# Altium project DiffTorch-PowerStage.PrjPcb
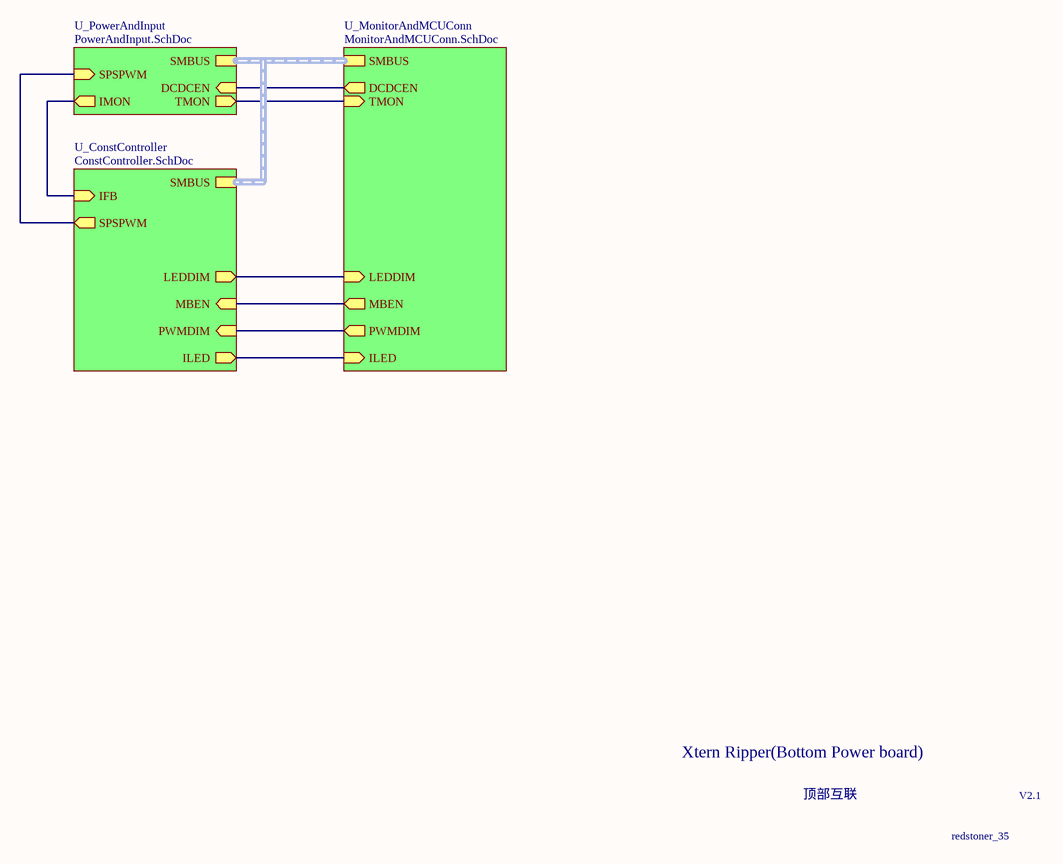
[diagram p0: main.SchDoc]
4 sheets, 73 parts. Net scope: hierarchical (ports join the sheet entries above them; power ports are global).
Board file: PCB1.PcbDoc
Sheets:
  main.SchDoc
    U_ConstController = ConstController.SchDoc
    U_MonitorAndMCUConn = MonitorAndMCUConn.SchDoc
    U_PowerAndInput = PowerAndInput.SchDoc

## Sheet main.SchDoc
size A4

### Sub-sheets
U_ConstController = ConstController.SchDoc: IFB (in), SPSPWM (out), SMBUS (harness SMBUS), PWMDIM (in), MBEN (in), ILED (out), LEDDIM (out)
U_MonitorAndMCUConn = MonitorAndMCUConn.SchDoc: SMBUS (harness SMBUS), PWMDIM (out), DCDCEN (out), MBEN (out), ILED (in), LEDDIM (in), TMON (in)
U_PowerAndInput = PowerAndInput.SchDoc: SMBUS (harness SMBUS), DCDCEN (in), TMON (out), IMON (out), SPSPWM (in)

### Nets
DCDCEN: sheet U_MonitorAndMCUConn/DCDCEN, sheet U_PowerAndInput/DCDCEN
IFB+: sheet U_ConstController/IFB, sheet U_PowerAndInput/IMON
ILEDO: sheet U_ConstController/ILED, sheet U_MonitorAndMCUConn/ILED
LEDDIM: sheet U_ConstController/LEDDIM, sheet U_MonitorAndMCUConn/LEDDIM
MBUCKEN: sheet U_ConstController/MBEN, sheet U_MonitorAndMCUConn/MBEN
PWM: sheet U_ConstController/SPSPWM, sheet U_PowerAndInput/SPSPWM
PWMDIM: sheet U_ConstController/PWMDIM, sheet U_MonitorAndMCUConn/PWMDIM
SPSTEMP: sheet U_MonitorAndMCUConn/TMON, sheet U_PowerAndInput/TMON

### Buses and harness runs
harness sheet U_ConstController/SMBUS = sheet U_MonitorAndMCUConn/SMBUS = sheet U_PowerAndInput/SMBUS

### Notes on the sheet
- Xtern Ripper(Bottom Power board)
- 顶部互联
- V2.1
- redstoner_35

## Sheet ConstController.SchDoc
size A4
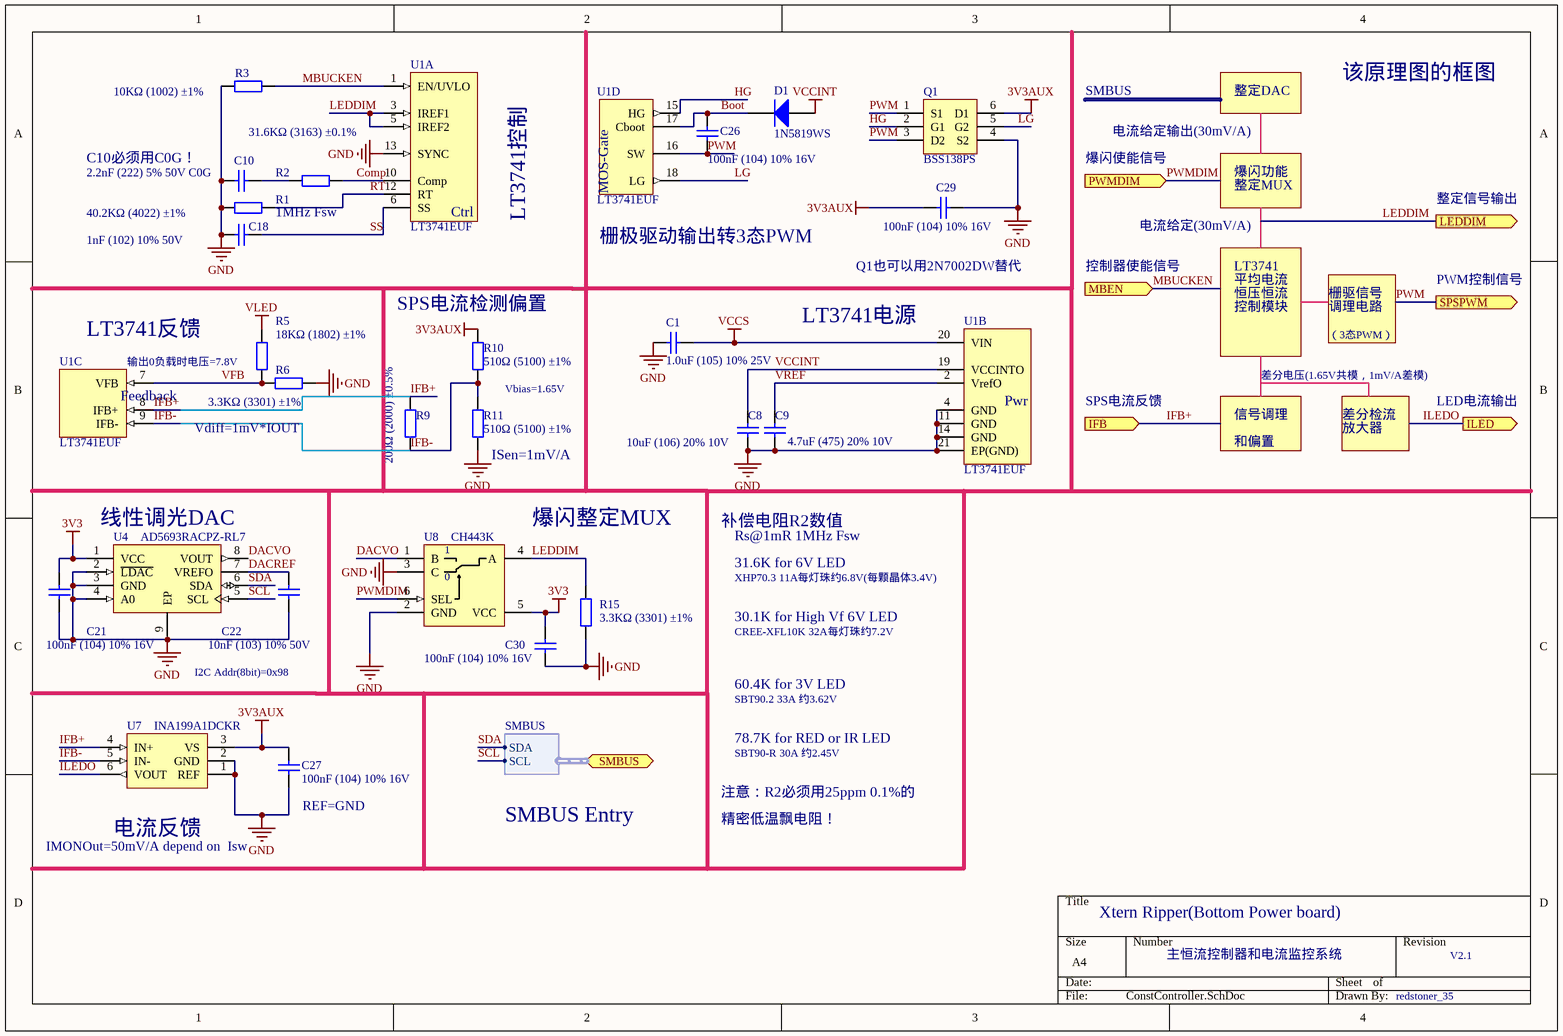
[diagram p1: ConstController.SchDoc]

### Parts
C1  1.0uF (105) 10% 25V  [0402_C]
C8  10uF (106) 20% 10V  [0402_C]
C9  4.7uF (475) 20% 10V  [0402_C]
C10  2.2nF (222) 5% 50V C0G  [0402_C]
C18  1nF (102) 10% 50V  [0402_C]
C21  100nF (104) 10% 16V  [0402_C]
C22  10nF (103) 10% 50V  [0402_C]
C26  100nF (104) 10% 16V  [0402_C]
C27  100nF (104) 10% 16V  [0402_C]
C29  100nF (104) 10% 16V  [0402_C]
C30  100nF (104) 10% 16V  [0402_C]
D1  1N5819WS  [SOD-323]
Q1  BSS138PS  [SC70-6]
R1  40.2KΩ (4022) ±1%  [0402_R]
R2  31.6KΩ (3163) ±0.1%  [0402_R]
R3  10KΩ (1002) ±1%  [0402_R]
R5  18KΩ (1802) ±1%  [0402_R]
R6  3.3KΩ (3301) ±1%  [0402_R]
R9  200Ω (2000) ±0.5%  [0402_R]
R10  510Ω (5100) ±1%  [0402_R]
R11  510Ω (5100) ±1%  [0402_R]
R15  3.3KΩ (3301) ±1%  [0402_R]
U1  LT3741EUF  [UF-05-08-1710A]  (parts A,B,C,D of 4)
U4  AD5693RACPZ-RL7  [LFCSP-8-10]
U7  INA199A1DCKR  [SC70-6]
U8  CH443K  [SC70-6]

### Ports
IFB (in), ILED (out), LEDDIM (out), MBEN (in), PWMDIM (in), SMBUS (harness SMBUS), SPSPWM (out)

### Harnesses
SMBUS: SDA, SCL

### Nets
3V3: C21.2 C30.2 U4.1(VCC) U8.5(VCC)
3V3AUX: C27.1 C29.1 Q1.6(D1) R10.1 U7.3(VS)
GND: C1.1 C8.1 C9.1 C10.2 C18.1 C21.1 C22.1 C27.2 C29.2 C30.1 Q1.4(S2) R1.1 R3.1 R6.2 R11.2 R15.1 U1.4(GND) U1.11(GND) U1.13(SYNC) U1.14(GND) U1.21(EP(GND)) U4.2(~{LDAC}) U4.3(GND) U4.4(A0) U4.9(EP) U7.1(REF) U7.2(GND) U8.2(GND) U8.3(C)
VCCINT: C8.2 D1.1(A) U1.19(VCCINTO)
VCCS: C1.2 U1.20(VIN)
VLED: R5.2
Boot: C26.2 D1.2(K) U1.17(Cboot)
Comp: R2.1 U1.10(Comp)
DACREF: C22.2 U4.7(VREFO)
DACVO: U4.8(VOUT) U8.1(B)
HG: Q1.2(G1) U1.15(HG)
IFB+: R9.2 U1.8(IFB+) U7.4(IN+) ; port IFB
IFB-: R9.1 R10.2 R11.1 U1.9(IFB-) U7.5(IN-)
ILEDO: U7.6(VOUT) ; port ILED
LEDDIM: R15.2 U1.3(IREF1) U1.5(IREF2) U8.4(A) ; port LEDDIM
LG: Q1.5(G2) U1.18(LG)
MBUCKEN: R3.2 U1.1(EN/UVLO) ; port MBEN
PWM: C26.1 Q1.1(S1) Q1.3(D2) U1.16(SW) ; port SPSPWM
PWMDIM: U8.6(SEL) ; port PWMDIM
RT: R1.2 U1.12(RT)
SCL: U4.5(SCL) ; port SMBUS.SCL
SDA: U4.6(SDA) ; port SMBUS.SDA
SS: C18.2 U1.6(SS)
VFB: R5.1 R6.1 U1.7(VFB)
VREF: C9.2 U1.2(VrefO)
NetC10_1: C10.1 R2.2

### Notes on the sheet
- SMBUS
- 整定DAC
- 该原理图的框图
- C10必须用C0G！
- 爆闪使能信号
- 电流给定输出(30mV/A)
- 爆闪功能
- (near R1) 1MHz Fsw
- LT3741控制
- (near U1) 栅极驱动输出转3态PWM
- 电流给定(30mV/A)
- 整定MUX
- 整定信号输出
- (near R10) SPS电流检测偏置
- Q1也可以用2N7002DW替代
- 控制器使能信号
- LT3741
- 平均电流
- 恒压恒流
- 控制模块
- 栅驱信号
- 调理电路
- PWM控制信号
- (near U1) LT3741反馈
- (near U1) 输出0负载时电压=7.8V
- LT3741电源
- 差分电压(1.65V共模，1mV/A差模)
- （3态PWM）
- Vdiff=1mV*IOUT
- Vbias=1.65V
- SPS电流反馈
- 信号调理
- 和偏置
- 差分检流
- 放大器
- LED电流输出
- (near R11) ISen=1mV/A
- (near U4) 线性调光DAC
- (near U8) 爆闪整定MUX
- 补偿电阻R2数值
- 31.6K for 6V LED
- Rs@1mR 1MHz Fsw
- XHP70.3 11A每灯珠约6.8V(每颗晶体3.4V)
- 30.1K for High Vf 6V LED
- CREE-XFL10K 32A每灯珠约7.2V
- I2C Addr(8bit)=0x98
- SBT90.2 33A 约3.62V
- 60.4K for 3V LED
- 78.7K for RED or IR LED
- SBT90-R 30A 约2.45V
- IMONOut=50mV/A depend on  Isw
- (near U7) 电流反馈
- (near C27) REF=GND
- SMBUS Entry
- 注意：R2必须用25ppm 0.1%的
- 精密低温飘电阻！
- Xtern Ripper(Bottom Power board)
- 主恒流控制器和电流监控系统
- V2.1
- redstoner_35
- (in symbol LT3741EUF, part A) Ctrl
- (in symbol LT3741EUF, part B) Pwr
- (in symbol LT3741EUF, part C) Feedback
- (in symbol LT3741EUF, part D) MOS-Gate
- (in symbol NC7SB3157P6X) 0

### Library data of the parts
C1 = 0402 1.0uF (105) 10% 25V: 贴片电容; ComponentLink1Description: 供应商链接; ComponentLink1URL: http://www.szlcsc.com/product/details_53938.html; Package: 0402; Supplier: LC; SuppliersPartNumber: C52923
C8 C9 = 0402 4.7uF (475) 20% 10V: 贴片电容; ComponentLink1Description: 供应商链接; ComponentLink1URL: http://www.szlcsc.com/product/details_24469.html; Package: 0402; Supplier: LC
  C8: SuppliersPartNumber: C??????
  C9: SuppliersPartNumber: C23733
C10 = 0402 2.2nF (222) 10% 50V: 贴片电容; Material: C0G/NP0; ComponentLink1Description: 供应商链接; ComponentLink1URL: http://www.szlcsc.com/product/details_1883.html; Package: 0402; Supplier: LC; SuppliersPartNumber: C?????????
C18 = 0402 1nF (102) 10% 50V: 贴片电容; ComponentLink1Description: 供应商链接; ComponentLink1URL: http://www.szlcsc.com/product/details_1875.html; Package: 0402; Supplier: LC; SuppliersPartNumber: C1523
C21 C26 C27 C29 C30 = 0402 100nF (104) 10% 16V: 贴片电容; ComponentLink1Description: 供应商链接; ComponentLink1URL: http://www.szlcsc.com/product/details_1877.html; Package: 0402; Supplier: LC; SuppliersPartNumber: C1525
C22 = 0402 10nF (103) 10% 50V: 贴片电容; ComponentLink1Description: 供应商链接; ComponentLink1URL: http://www.szlcsc.com/product/details_15869.html; Package: 0402; Supplier: LC; SuppliersPartNumber: C15195
D1 = SOD-323 1N4148WS T4: 二极管; ComponentLink1Description: 供应商链接; ComponentLink1URL: http://www.szlcsc.com/product/details_2485.html; Package: SOD-323; Supplier: LC; SuppliersPartNumber: C?????
Q1 = 2N7002DW: Dual N-Channel MOSFET 60V320mA SOT-363
R1 R2 = 0402 49.9KΩ (4992) 1%: 贴片电阻; ComponentLink1Description: 供应商链接; ComponentLink1URL: http://www.szlcsc.com/product/details_26640.html; Package: 0402; Supplier: LC; SuppliersPartNumber: C??????
R3 = 0402 10KΩ (1002) 1%: 贴片电阻; ComponentLink1Description: 供应商链接; ComponentLink1URL: http://www.szlcsc.com/product/details_26487.html; Package: 0402; Supplier: LC; SuppliersPartNumber: C25744
R5 = 0402 18KΩ (1802) 1%: 贴片电阻; ComponentLink1Description: 供应商链接; ComponentLink1URL: http://www.szlcsc.com/product/details_26505.html; Package: 0402; Supplier: LC; SuppliersPartNumber: C25762
R6 R15 = 0402 3.3KΩ (3301) 1%: 贴片电阻; ComponentLink1Description: 供应商链接; ComponentLink1URL: http://www.szlcsc.com/product/details_26633.html; Package: 0402; Supplier: LC; SuppliersPartNumber: C25890
R9 = 0402 200Ω (2000) 1%: 贴片电阻; ComponentLink1Description: 供应商链接; ComponentLink1URL: http://www.szlcsc.com/product/details_25830.html; Package: 0402; Supplier: LC; SuppliersPartNumber: C????
R10 R11 = 0402 510Ω (5100) 1%: 贴片电阻; ComponentLink1Description: 供应商链接; ComponentLink1URL: http://www.szlcsc.com/product/details_25866.html; Package: 0402; Supplier: LC; SuppliersPartNumber: C25123
U1 = LT3741EUF: Constant Voltage/Current Sync Buck controller(external switch)
U4 = AD5693RACPZ-RL7: 16bit I2C Nano DAC with 2.5V internal Ref in 2x2mm SON
U7 = INA199A2DCKR: 50Khz 50V/V 26V Max High Side Current Op Amp.
U8 = NC7SB3157P6X: Low-Voltage Analog Switch SPDT,1.8-5V Power

## Sheet MonitorAndMCUConn.SchDoc
size A4
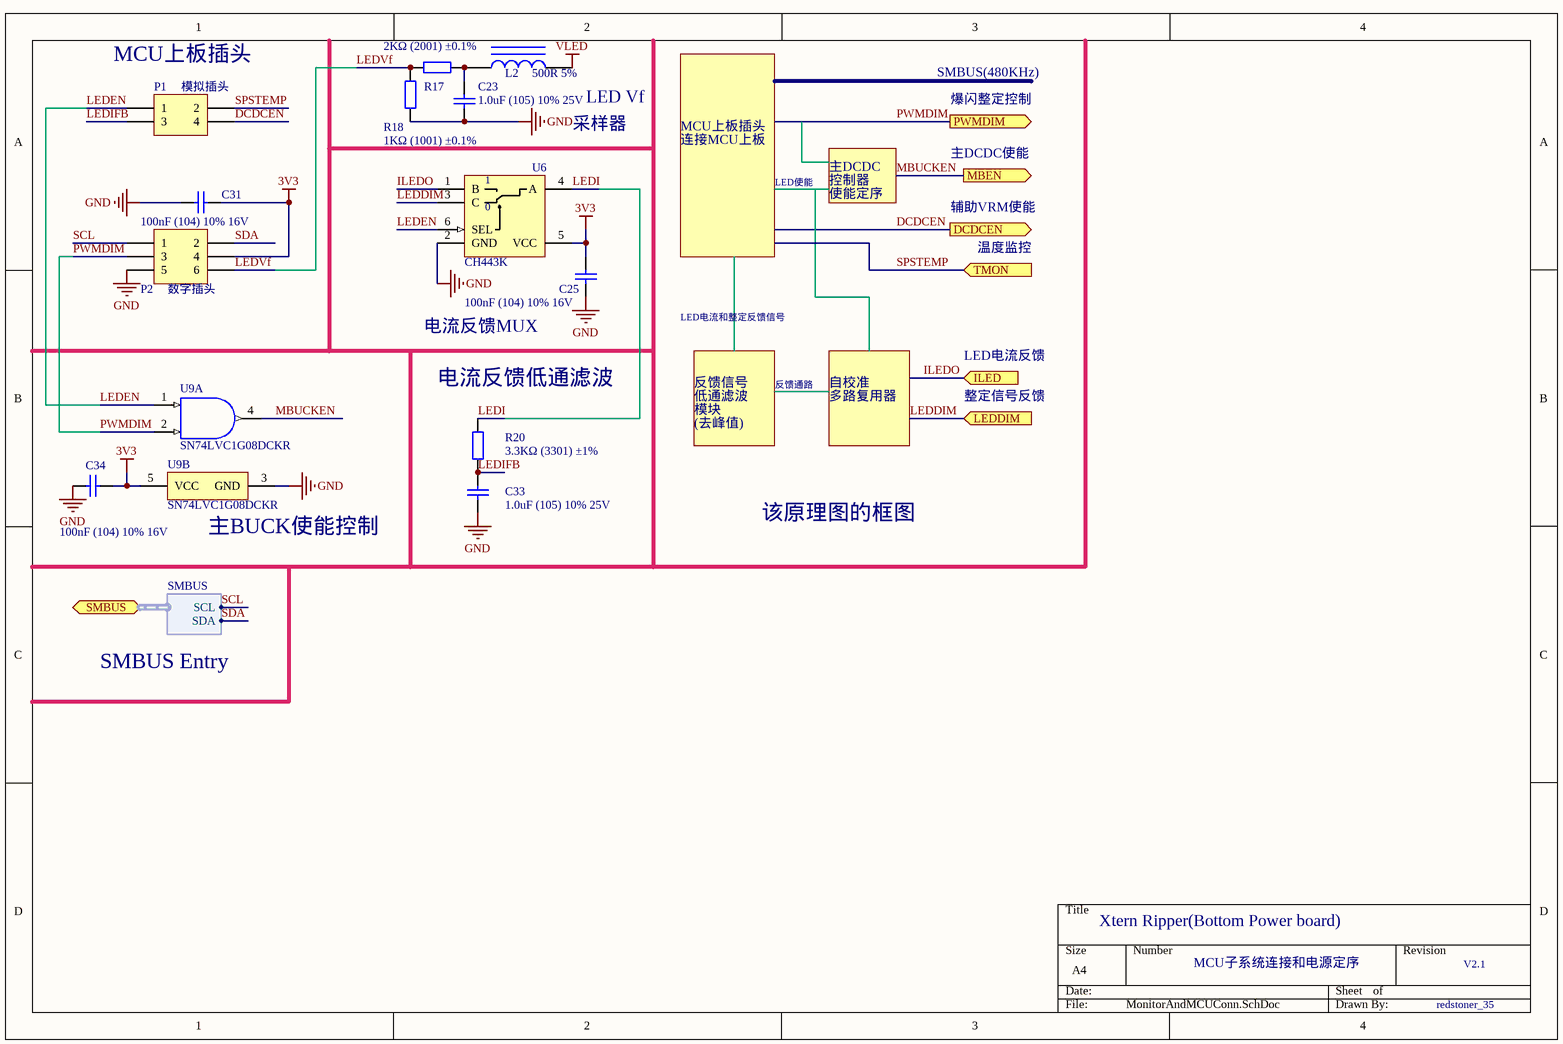
[diagram p2: MonitorAndMCUConn.SchDoc]

### Parts
C23  1.0uF (105) 10% 25V  [0402_C]
C25  100nF (104) 10% 16V  [0402_C]
C31  100nF (104) 10% 16V  [0402_C]
C33  1.0uF (105) 10% 25V  [0402_C]
C34  100nF (104) 10% 16V  [0402_C]
L2  500R 5%  [0402_L]
P1  模拟插头  [MHDR2X2]
P2  数字插头  [MHDR2X3]
R17  2KΩ (2001) ±0.1%  [0402_R]
R18  1KΩ (1001) ±0.1%  [0402_R]
R20  3.3KΩ (3301) ±1%  [0402_R]
U6  CH443K  [SC70-6]
U9  SN74LVC1G08DCKR  [DCK0005A_N]  (parts A,B of 2)

### Ports
DCDCEN (out), ILED (in), LEDDIM (in), MBEN (out), PWMDIM (out), SMBUS (harness SMBUS), TMON (in)

### Harnesses
SMBUS: SDA, SCL

### Nets
3V3: C25.2 C31.2 C34.2 P2.4 U6.5(VCC) U9.5(VCC)
GND: C23.1 C25.1 C31.1 C33.1 C34.1 P2.5 R18.1 U6.2(GND) U9.3(GND)
VLED: L2.1
DCDCEN: P1.4 ; port DCDCEN
ILEDO: U6.1(B) ; port ILED
LEDDIM: U6.3(C) ; port LEDDIM
LEDEN: P1.1 U6.6(SEL) U9.1(A)
LEDI: R20.2 U6.4(A)
LEDIFB: C33.2 P1.3 R20.1
LEDVf: P2.6 R17.2 R18.2
MBUCKEN: U9.4(Y) ; port MBEN
PWMDIM: P2.3 U9.2(B) ; port PWMDIM
SCL: P2.1 ; port SMBUS.SCL
SDA: P2.2 ; port SMBUS.SDA
SPSTEMP: P1.2 ; port TMON
NetC23_2: C23.2 L2.2 R17.1

### Notes on the sheet
- (near P1) MCU上板插头
- (near L2) LED Vf
- SMBUS(480KHz)
- 爆闪整定控制
- 采样器
- MCU上板插头
- 连接MCU上板
- LED使能
- 主DCDC
- 控制器
- 主DCDC使能
- 使能定序
- 辅助VRM使能
- 温度监控
- LED电流和整定反馈信号
- 电流反馈MUX
- (near R20) 电流反馈低通滤波
- 反馈信号
- 反馈通路
- 自校准
- LED电流反馈
- 低通滤波
- 模块
- (去峰值)
- 多路复用器
- 整定信号反馈
- 该原理图的框图
- (near U9) 主BUCK使能控制
- SMBUS Entry
- Xtern Ripper(Bottom Power board)
- MCU子系统连接和电源定序
- V2.1
- redstoner_35
- (in symbol NC7SB3157P6X) 0

### Library data of the parts
C23 C33 = 0402 1.0uF (105) 10% 25V: 贴片电容; ComponentLink1Description: 供应商链接; ComponentLink1URL: http://www.szlcsc.com/product/details_53938.html; Package: 0402; Supplier: LC; SuppliersPartNumber: C52923
C25 C31 C34 = 0402 100nF (104) 10% 16V: 贴片电容; ComponentLink1Description: 供应商链接; ComponentLink1URL: http://www.szlcsc.com/product/details_1877.html; Package: 0402; Supplier: LC; SuppliersPartNumber: C1525
L2 = 0402 27nH 5%: 贴片磁珠; ComponentLink1Description: 供应商链接; ComponentLink1URL: http://www.szlcsc.com/product/details_19533.html; Package: 0402; Supplier: LC; SuppliersPartNumber: C?????????
P1 = MHDR2X2: Header, 2-Pin, Dual row; LatestRevisionDate: 17-Jul-2002; LatestRevisionNote: Re-released for DXP Platform.; Publisher: Altium Limited
P2 = MHDR2X3: Header, 3-Pin, Dual row; LatestRevisionDate: 17-Jul-2002; LatestRevisionNote: Re-released for DXP Platform.; Publisher: Altium Limited
R17 = 0402 2KΩ (2001) 1%: 贴片电阻; ComponentLink1Description: 供应商链接; ComponentLink1URL: http://www.szlcsc.com/product/details_4516.html; Package: 0402; Supplier: LC; SuppliersPartNumber: C4109
R18 = 0402 1KΩ (1001) 1%: 贴片电阻; ComponentLink1Description: 供应商链接; ComponentLink1URL: http://www.szlcsc.com/product/details_12256.html; Package: 0402; Supplier: LC; SuppliersPartNumber: C11702
R20 = 0402 3.3KΩ (3301) 1%: 贴片电阻; ComponentLink1Description: 供应商链接; ComponentLink1URL: http://www.szlcsc.com/product/details_26633.html; Package: 0402; Supplier: LC; SuppliersPartNumber: C25890
U6 = NC7SB3157P6X: as U8 on sheet ConstController
U9 = SN74LVC1G08DCKR: Single 2-Input Positive-AND Gate, DCK0005A, LARGE T&R; Manufacturer: Texas Instruments; VCC(Min)(V): 1.65; VCC(Max)(V): 5.5; Output Type: CMOS; ICC @ Nom Voltage(Max)(mA): 0.01; Input Type: CMOS/TTL; Bits(#): 1; F @ Nom Voltage(Max)(Mhz): 150; Rating: Catalog; Technology Family: LVC; Voltage(Nom)(V): 1.8,2.5,3.3,5; Schmitt Trigger: No; Output Drive (IOL/IOH)(Max)(mA): 32/-32; tpd @ Nom Voltage(Max)(ns): 4.5,6,4,5; Logic: True; Gate Type: AND; DatasheetVersion: SCES217Y; PackageReference: DCK0005A; Supplier 1: Mouser; Supplier Part Number 1: 595-SN74LVC1G08DCKR; Supplier 2: Digi-Key; Supplier Part Number 2: 296-11602-2-ND; Supplier 3: Digi-Key; Supplier Part Number 3: 296-11602-1-ND; Supplier 4: Digi-Key; Supplier Part Number 4: 296-11602-6-ND; Generic Part Number: SN74LVC1G08; Operating Temperature Range(C): -40 to 125,-40 to 85; Sub-Family: AND Gate; 3-State Output: No; PartNumber: SN74LVC1G08DCKR; ComponentLink1Description: Manufacturer URL; ComponentLink1URL: http://www.ti.com/; ComponentLink2Description: Datasheet; ComponentLink2URL: http://www.ti.com/lit/ds/symlink/sn74lvc1g08.pdf

## Sheet PowerAndInput.SchDoc
size A4
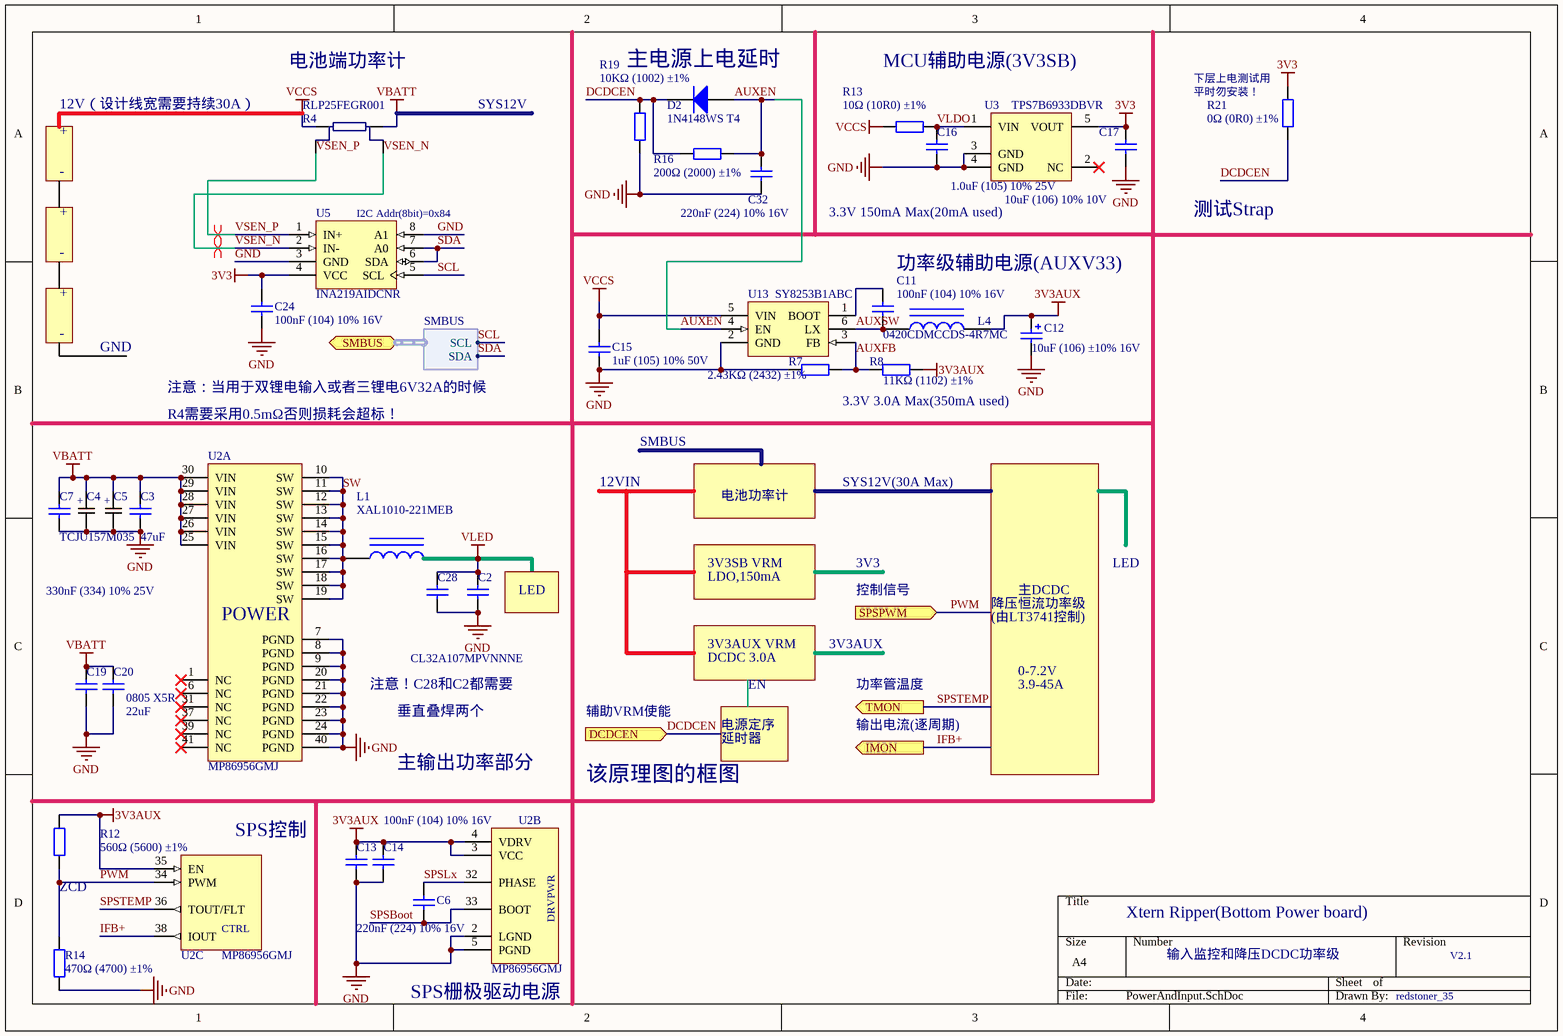
[diagram p3: PowerAndInput.SchDoc]

### Parts
C2  CC1210KKX5RBB476  [1210C]  (value not drawn)
C3  value 47uF  [1210C]  (hidden comment: CC1210KKX5RBB476)
C4  TCJU157M035  [CAPMP7362X41N]
C5  TCJU157M035  [CAPMP7362X41N]  (value not drawn)
C6  220nF (224) 10% 16V  [0402_C]
C7  330nF (334) 10% 25V  [0603_C]
C11  100nF (104) 10% 16V  [0402_C]
C12  10uF (106) ±10% 16V  [CASE-A_3216]
C13  100nF (104) 10% 16V  [0402_C]  (value not drawn)
C14  100nF (104) 10% 16V  [0402_C]
C15  1uF (105) 10% 50V  [0603_C]
C16  1.0uF (105) 10% 25V  [0402_C]
C17  10uF (106) 10% 10V  [0603_C]
C19  0805 X5R  [0805C]  (value not drawn)
C20  0805 X5R  value 22uF  [0805C]
C24  100nF (104) 10% 16V  [0402_C]
C28  CL32A107MPVNNNE  [1210C]
C32  220nF (224) 10% 16V  [0402_C]
D2  1N4148WS T4  [SOD-323]
L1  XAL1010-221MEB  [XAL1010-XXXME]
L4  0420CDMCCDS-4R7MC  [0420CDMCCDS-***MC]
R4  RLP25FEGR001  [2512-Virtual4Wire]
R7  2.43KΩ (2432) ±1%  [0402_R]
R8  11KΩ (1102) ±1%  [0402_R]
R12  560Ω (5600) ±1%  [0402_R]
R13  10Ω (10R0) ±1%  [0402_R]
R14  470Ω (4700) ±1%  [0402_R]
R16  200Ω (2000) ±1%  [0402_R]
R19  10KΩ (1002) ±1%  [0402_R]
R21  0Ω (0R0) ±1%  [0402_R]
U2  MP86956GMJ  [TDA21490]  (parts A,B,C of 3)
U3  TPS7B6933DBVR  [SOT95P245X110-5N]
U5  INA219AIDCNR  [SOT23-8]
U13  SY8253B1ABC  [SOT95P245X110-6N]

### Ports
DCDCEN (in), IMON (out), SMBUS (harness SMBUS), SPSPWM (in), TMON (out)

### Harnesses
SMBUS: SDA, SCL

### Nets
3V3: C17.2 C24.2 R21.2 U3.5(VOUT) U5.4(VCC)
3V3AUX: C12.1 C13.2 C14.2 L4.2 R8.2 R12.2 U2.3(VCC) U2.4(VDRV) U2.35(EN)
GND: C2.1 C3.1 C4.2(-) C5.2(-) C7.1 C12.2 C13.1 C14.1 C15.1 C16.1 C17.1 C19.1 C20.1 C24.1 C28.1 C32.2 R7.1 R14.1 R19.1 U2.2(LGND) U2.5(PGND) U2.7(PGND) U2.8(PGND) U2.9(PGND) U2.20(PGND) U2.21(PGND) U2.22(PGND) U2.23(PGND) U2.24(PGND) U2.40(PGND) U3.3(GND) U3.4(GND) U5.3(GND) U5.8(A1) U13.2(GND)
VBATT: C3.2 C4.1(+) C5.1(+) C7.2 C19.2 C20.2 R4.0(CIN) U2.25(VIN) U2.26(VIN) U2.27(VIN) U2.28(VIN) U2.29(VIN) U2.30(VIN)
VCCS: C15.2 R4.1(CIN) R13.1 U13.5(VIN)
VLED: C2.2 C28.2 L1.2
AUXEN: C32.1 D2.1(A) R16.2 U13.4(EN)
AUXFB: R7.2 R8.1 U13.3(FB)
AUXSW: C11.1 L4.1 U13.6(LX)
DCDCEN: D2.2(K) R16.1 R19.2 R21.1 ; port DCDCEN
IFB+: U2.38(IOUT) ; port IMON
PWM: R12.1 R14.2 U2.34(PWM) ; port SPSPWM
SCL: U5.5(SCL) ; port SMBUS.SCL
SDA: U5.6(SDA) U5.7(A0) ; port SMBUS.SDA
SPSBoot: C6.1 U2.33(BOOT)
SPSLx: C6.2 U2.32(PHASE)
SPSTEMP: U2.36(TOUT/FLT) ; port TMON
SW: L1.1 U2.10(SW) U2.11(SW) U2.12(SW) U2.13(SW) U2.14(SW) U2.15(SW) U2.16(SW) U2.17(SW) U2.18(SW) U2.19(SW)
VLDO: C16.2 R13.2 U3.1(VIN)
VSEN_N: R4.2(CIN) U5.2(IN-)
VSEN_P: R4.3(CIN) U5.1(IN+)
NetC11_2: C11.2 U13.1(BOOT)

Not connected (* = marked no-connect by the designer): U2 1(NC)* 6(NC)* 31(NC)* 37(NC)* 39(NC)* 41(NC)*; U3 2(NC)*

### Layout directives
differential pair: VSEN_N, VSEN_P

### Notes on the sheet
- 12V（设计线宽需要持续30A）
- 电池端功率计
- SYS12V
- 主电源上电延时
- MCU辅助电源(3V3SB)
- 下层上电测试用
- 平时勿安装！
- +
- -
- (near U5) I2C Addr(8bit)=0x84
- 3.3V 150mA Max(20mA used)
- 测试Strap
- (near C11) 功率级辅助电源(AUXV33)
- GND
- 注意：当用于双锂电输入或者三锂电6V32A的时候
- R4需要采用0.5mΩ否则损耗会超标！
- SMBUS
- 3.3V 3.0A Max(350mA used)
- 12VIN
- 电池功率计
- SYS12V(30A Max)
- 3V3SB VRM
- LDO,150mA
- 3V3
- LED
- (near C2) LED
- 3V3AUX VRM
- 3V3AUX
- 控制信号
- 降压恒流功率级
- (由LT3741控制)
- 主DCDC
- 注意！C28和C2都需要
- 垂直叠焊两个
- 辅助VRM使能
- DCDC 3.0A
- EN
- 功率管温度
- 0-7.2V
- 3.9-45A
- 主输出功率部分
- 该原理图的框图
- 电源定序
- 延时器
- 输出电流(逐周期)
- SPS控制
- (near R12) ZCD
- Xtern Ripper(Bottom Power board)
- 输入监控和降压DCDC功率级
- V2.1
- (near U2) SPS栅极驱动电源
- redstoner_35
- (in symbol MP86957, part A) POWER
- (in symbol MP86957, part B) DRVPWR
- (in symbol MP86957, part C) CTRL

### Library data of the parts
C2 C28 = Cap: 1210 MLCC X5R 16V 10%; Value: 47uF; Published: 8-Jun-2000; LatestRevisionDate: 17-Jul-2002; LatestRevisionNote: Re-released for DXP Platform.; PackageReference: RAD-0.3; Publisher: Altium Limited; PackageDescription: Radial Cap, Thru-Hole; 2 Leads; 0.3 in Pin Spacing
C3 = Cap: 1210 MLCC X5R 16V 10%; Published: 8-Jun-2000; LatestRevisionDate: 17-Jul-2002; LatestRevisionNote: Re-released for DXP Platform.; PackageReference: RAD-0.3; Publisher: Altium Limited; PackageDescription: Radial Cap, Thru-Hole; 2 Leads; 0.3 in Pin Spacing
C4 C5 = TCJU157M035R0100E: 35V 150uF Conductive Polymer Solid Capacitor 100mR ESR. 7362 Size
C6 C32 = 0402 220nF (224) 10% 16V: 贴片电容; ComponentLink1Description: 供应商链接; ComponentLink1URL: http://www.szlcsc.com/product/details_17456.html; Package: 0402; Supplier: LC; SuppliersPartNumber: C16772
C7 = 0603 330nF (334) 10% 25V: 贴片电容; ComponentLink1Description: 供应商链接; ComponentLink1URL: http://www.szlcsc.com/product/details_1967.html; Package: 0603; Supplier: LC; SuppliersPartNumber: C1615
C11 C13 C14 C24 = 0402 100nF (104) 10% 16V: 贴片电容; ComponentLink1Description: 供应商链接; ComponentLink1URL: http://www.szlcsc.com/product/details_1877.html; Package: 0402; Supplier: LC; SuppliersPartNumber: C1525
C12 = 3216 10uF (106) 10% 16V: 钽电容; ComponentLink1Description: 供应商链接; ComponentLink1URL: http://www.szlcsc.com/product/details_7643.html; Package: 3216; Supplier: LC; SuppliersPartNumber: C7171
C15 = 0603 1uF (105) 10% 50V: 贴片电容; ComponentLink1Description: 供应商链接; ComponentLink1URL: http://www.szlcsc.com/product/details_16531.html; Package: 0603; Supplier: LC; SuppliersPartNumber: C15849
C16 = 0402 1.0uF (105) 10% 25V: 贴片电容; ComponentLink1Description: 供应商链接; ComponentLink1URL: http://www.szlcsc.com/product/details_53938.html; Package: 0402; Supplier: LC; SuppliersPartNumber: C52923
C17 = 0603 10uF (106) 10% 10V: 贴片电容; ComponentLink1Description: 供应商链接; ComponentLink1URL: http://www.szlcsc.com/product/details_20411.html; Package: 0603; Supplier: LC; SuppliersPartNumber: C19702
C19 = Cap: Capacitor; Value: 22uF; Published: 8-Jun-2000; LatestRevisionDate: 17-Jul-2002; LatestRevisionNote: Re-released for DXP Platform.; PackageReference: RAD-0.3; Publisher: Altium Limited; PackageDescription: Radial Cap, Thru-Hole; 2 Leads; 0.3 in Pin Spacing
C20 = Cap: Capacitor; Published: 8-Jun-2000; LatestRevisionDate: 17-Jul-2002; LatestRevisionNote: Re-released for DXP Platform.; PackageReference: RAD-0.3; Publisher: Altium Limited; PackageDescription: Radial Cap, Thru-Hole; 2 Leads; 0.3 in Pin Spacing
D2 = SOD-323 1N4148WS T4: 二极管; ComponentLink1Description: 供应商链接; ComponentLink1URL: http://www.szlcsc.com/product/details_2485.html; Package: SOD-323; Supplier: LC; SuppliersPartNumber: C2128
L1 = Inductor Iron: Coilcraft Inductor XAL1010 Series; Value: 0.22uH; Published: 24-Mar-1999; LatestRevisionDate: 17-Jul-2002; LatestRevisionNote: Re-released for DXP Platform.; PackageReference: AXIAL-0.9; Publisher: Altium Limited; PackageDescription: Axial Device, Thru-Hole; 2 Leads; 0.9 in Pin Spacing
L4 = Inductor Iron: Magnetic-Core Inductor; Value: 4.7uH; Published: 24-Mar-1999; LatestRevisionDate: 17-Jul-2002; LatestRevisionNote: Re-released for DXP Platform.; PackageReference: AXIAL-0.9; Publisher: Altium Limited; PackageDescription: Axial Device, Thru-Hole; 2 Leads; 0.9 in Pin Spacing
R4 = shunt: 2512 1mΩ合金检流电阻 3W
R7 R8 R21 = 0402 0Ω (0R0) 1%: 贴片电阻; ComponentLink1Description: 供应商链接; ComponentLink1URL: http://www.szlcsc.com/product/details_17853.html; Package: 0402; Supplier: LC
  R7 R8: SuppliersPartNumber: C????
  R21: SuppliersPartNumber: C17168
R12 = 0402 22KΩ (2202) 1%: 贴片电阻; ComponentLink1Description: 供应商链接; ComponentLink1URL: http://www.szlcsc.com/product/details_26511.html; Package: 0402; Supplier: LC; SuppliersPartNumber: C??????
R13 = 0402 10Ω (10R0) 1%: 贴片电阻; ComponentLink1Description: 供应商链接; ComponentLink1URL: http://www.szlcsc.com/product/details_25820.html; Package: 0402; Supplier: LC; SuppliersPartNumber: C25077
R14 = 0402 470Ω (4700) 1%: 贴片电阻; ComponentLink1Description: 供应商链接; ComponentLink1URL: http://www.szlcsc.com/product/details_25860.html; Package: 0402; Supplier: LC; SuppliersPartNumber: C25117
R16 = 0402 200Ω (2000) 1%: 贴片电阻; ComponentLink1Description: 供应商链接; ComponentLink1URL: http://www.szlcsc.com/product/details_25830.html; Package: 0402; Supplier: LC; SuppliersPartNumber: C25087
R19 = 0402 10KΩ (1002) 1%: 贴片电阻; ComponentLink1Description: 供应商链接; ComponentLink1URL: http://www.szlcsc.com/product/details_26487.html; Package: 0402; Supplier: LC; SuppliersPartNumber: C25744
U2 = MP86957: MPS 70A INTELLI-PHASE SPS in 5x6mm QFN41
U3 = TPS7B6933DBVR: 150mA 40V max input Ultra low Iq LDO,fixed 3.3V output
U5 = INA219AIDCNR: 26V Dual Direction 12bit I2C Power Gauge SOT23-8
U13 = SY8120: 3A 23V Input 500KHz Sync step down converter

## Nets that join several sheets
3V3: ConstController (C21.2 C30.2 U4.1 U8.5), MonitorAndMCUConn (6 pins), PowerAndInput (5 pins)
3V3AUX: ConstController (5 pins), PowerAndInput (9 pins)
GND: ConstController (29 pins), MonitorAndMCUConn (9 pins), PowerAndInput (35 pins)
VCCS: ConstController (C1.2 U1.20), PowerAndInput (C15.2 R4.1 R13.1 U13.5)
VLED: ConstController (R5.2), MonitorAndMCUConn (L2.1), PowerAndInput (C2.2 C28.2 L1.2)
DCDCEN: MonitorAndMCUConn (P1.4), PowerAndInput (D2.2 R16.1 R19.2 R21.1)
IFB+: ConstController (R9.2 U1.8 U7.4), PowerAndInput (U2.38)
ILEDO: ConstController (U7.6), MonitorAndMCUConn (U6.1)
LEDDIM: ConstController (R15.2 U1.3 U1.5 U8.4), MonitorAndMCUConn (U6.3)
MBUCKEN: ConstController (R3.2 U1.1), MonitorAndMCUConn (U9.4)
PWM: ConstController (C26.1 Q1.1 Q1.3 U1.16), PowerAndInput (R12.1 R14.2 U2.34)
PWMDIM: ConstController (U8.6), MonitorAndMCUConn (P2.3 U9.2)
SCL: ConstController (U4.5), MonitorAndMCUConn (P2.1), PowerAndInput (U5.5)
SDA: ConstController (U4.6), MonitorAndMCUConn (P2.2), PowerAndInput (U5.6 U5.7)
SPSTEMP: MonitorAndMCUConn (P1.2), PowerAndInput (U2.36)